# Altium project SNES TST Main.PrjPcb (part 2 of 2)

## Sheet Connectors.SchDoc: SNES TST Main
size A4; SheetNumber: 4; SheetTotal: 7
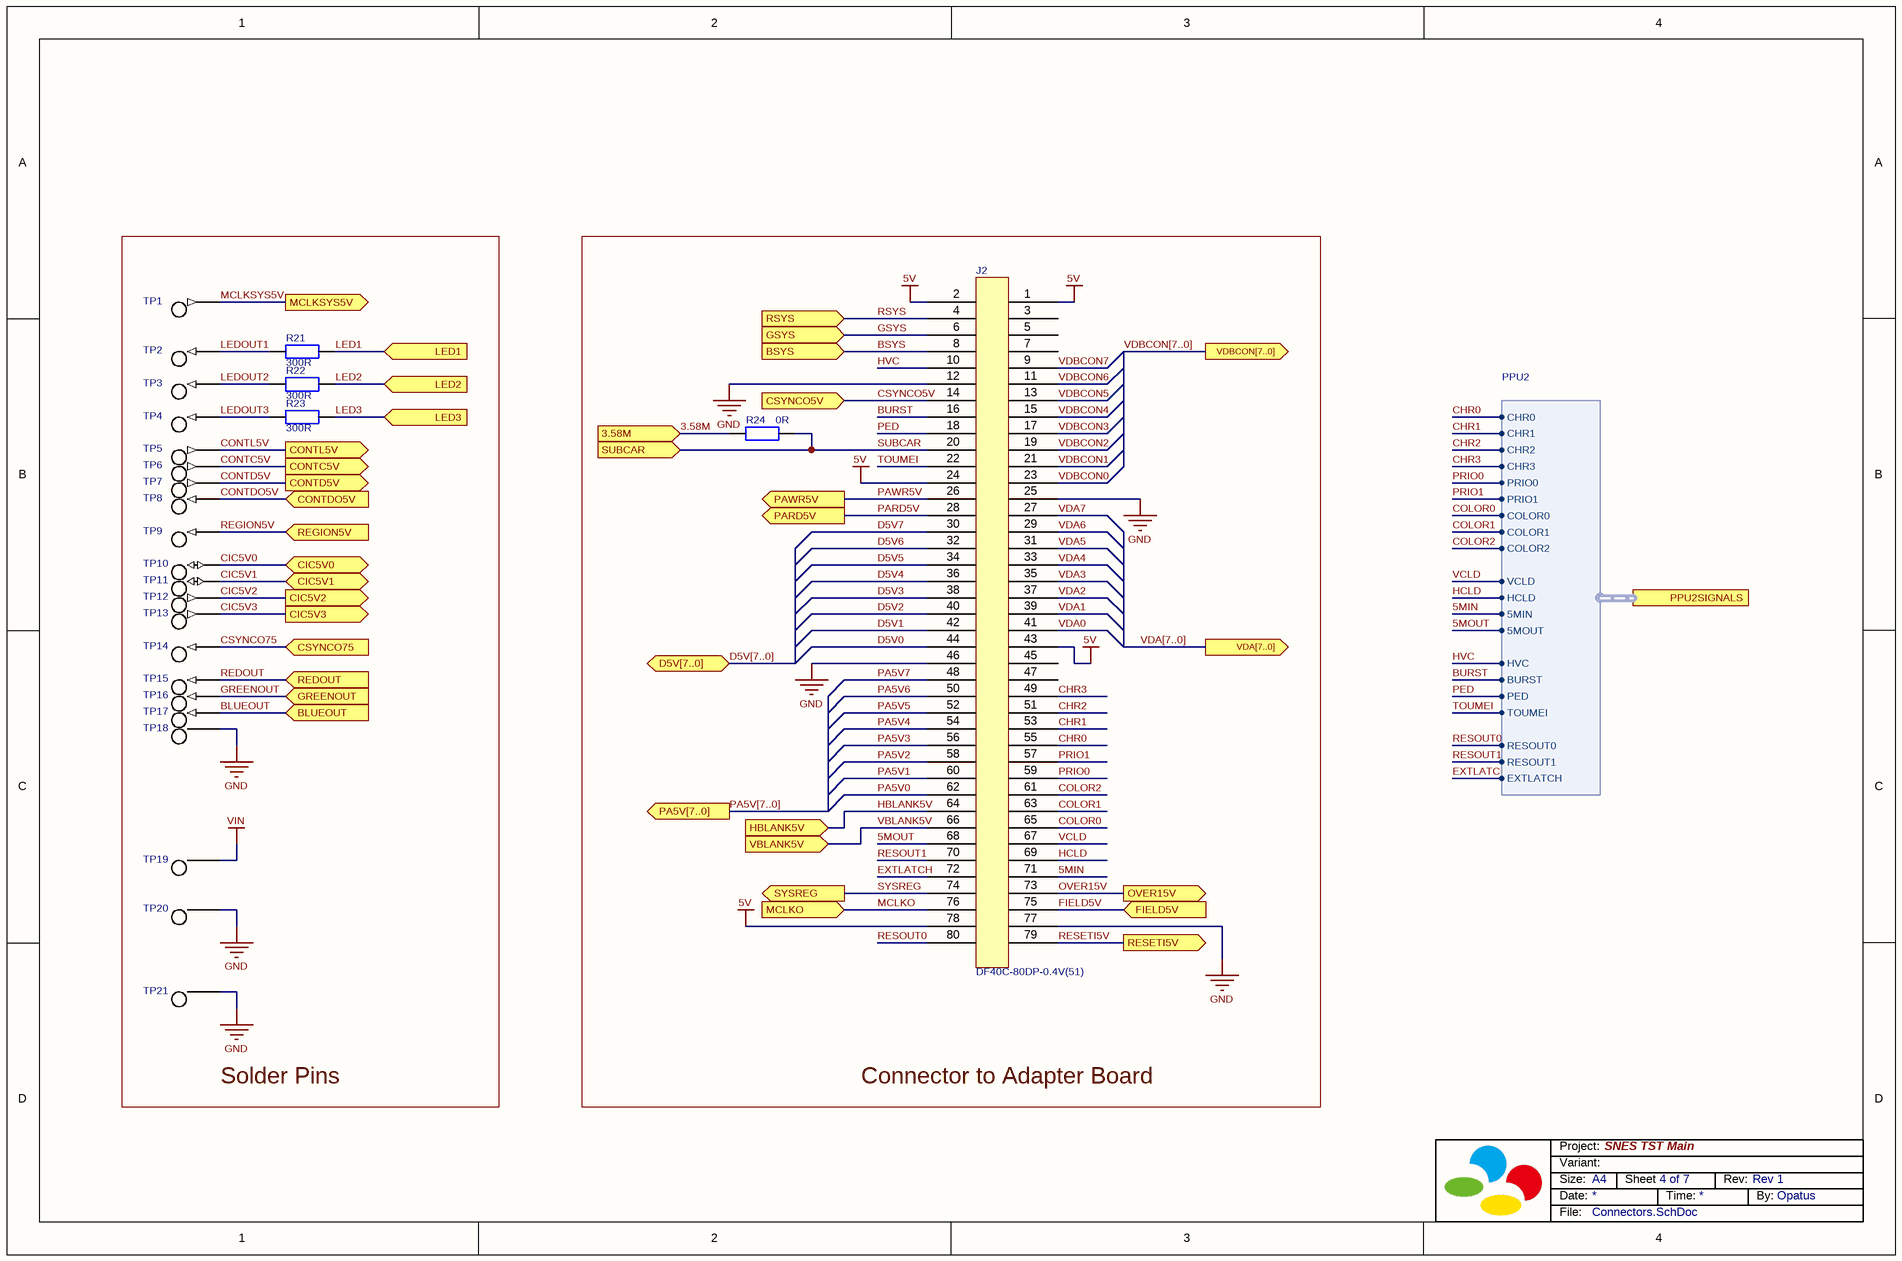
[diagram p6: Connectors.SchDoc]

### Parts
J2  Manufacturer_Part_Number: DF40C-80DP-0.4V(51)  [DF40C-80DP]  (hidden comment: DF40C-80DP)
R21  value 300R  [Res_0603_Chip]  (hidden comment: Resistor 300R 0603 ±1%)
R22  value 300R  [Res_0603_Chip]  (hidden comment: Resistor 300R 0603 ±1%)
R23  value 300R  [Res_0603_Chip]  (hidden comment: Resistor 300R 0603 ±1%)
R24  value 0R  [Res_0603_Chip]  (hidden comment: Resistor 0R 0603 ±1%)
TP1  Pin Connector  [Pin Connector Small]  (value not drawn)  (no BOM)
TP2  Pin Connector  [Pin Connector Small]  (value not drawn)  (no BOM)
TP3  Pin Connector  [Pin Connector Small]  (value not drawn)  (no BOM)
TP4  Pin Connector  [Pin Connector Small]  (value not drawn)  (no BOM)
TP5  Pin Connector  [Pin Connector Small]  (value not drawn)  (no BOM)
TP6  Pin Connector  [Pin Connector Small]  (value not drawn)  (no BOM)
TP7  Pin Connector  [Pin Connector Small]  (value not drawn)  (no BOM)
TP8  Pin Connector  [Pin Connector Small]  (value not drawn)  (no BOM)
TP9  Pin Connector  [Pin Connector Small]  (value not drawn)  (no BOM)
TP10  Pin Connector  [Pin Connector Small]  (value not drawn)  (no BOM)
TP11  Pin Connector  [Pin Connector Small]  (value not drawn)  (no BOM)
TP12  Pin Connector  [Pin Connector Small]  (value not drawn)  (no BOM)
TP13  Pin Connector  [Pin Connector Small]  (value not drawn)  (no BOM)
TP14  Pin Connector  [Pin Connector Small]  (value not drawn)  (no BOM)
TP15  Pin Connector  [Pin Connector Small]  (value not drawn)  (no BOM)
TP16  Pin Connector  [Pin Connector Small]  (value not drawn)  (no BOM)
TP17  Pin Connector  [Pin Connector Small]  (value not drawn)  (no BOM)
TP18  Pin Connector  [Pin Connector Small]  (value not drawn)  (no BOM)
TP19  Pin Connector  [Pin Connector Small]  (value not drawn)  (no BOM)
TP20  Pin Connector  [Pin Connector Small]  (value not drawn)  (no BOM)
TP21  Pin Connector  [Pin Connector Small]  (value not drawn)  (no BOM)

### Blocks framed on the sheet
Solder Pins: R21-R23 TP1-TP21
Connector to Adapter Board: J2 R24

### Ports
3.58M (in), BLUEOUT (in), BSYS (in), CIC5V0 (bidir), CIC5V1 (bidir), CIC5V2 (out), CIC5V3 (out), CONTC5V (out), CONTD5V (out), CONTDO5V (in), CONTL5V (out), CSYNCO5V (in), CSYNCO75 (in), D5V[7..0] (bidir), FIELD5V (in), GREENOUT (in), GSYS (in), HBLANK5V (in), LED1 (in), LED2 (in), LED3 (in), MCLKO (in), MCLKSYS5V (out), OVER15V (out), PA5V[7..0] (out), PARD5V (out), PAWR5V (out), PPU2SIGNALS (harness PPU2), REDOUT (in), REGION5V (in), RESETI5V (out), RSYS (in), SUBCAR (in), SYSREG (out), VBLANK5V (in), VDA[7..0] (out), VDBCON[7..0] (out)

### Harnesses
PPU2: CHR0, CHR1, CHR2, CHR3, PRIO0, PRIO1, COLOR0, COLOR1, COLOR2, VCLD, HCLD, 5MIN, 5MOUT, HVC, BURST, PED, TOUMEI, RESOUT0, RESOUT1, EXTLATCH

### Nets
5V: J2.1 J2.2 J2.24 J2.43 J2.78
GND: J2.12 J2.25 J2.46 J2.77 TP18.1 TP20.1 TP21.1
VIN: TP19.1
3.58M: R24.2 ; port 3.58M
5MIN: J2.71 ; port PPU2SIGNALS.5MIN
5MOUT: J2.68 ; port PPU2SIGNALS.5MOUT
BLUEOUT: TP17.1 ; port BLUEOUT
BSYS: J2.8 ; port BSYS
BURST: J2.16 ; port PPU2SIGNALS.BURST
CHR0: J2.55 ; port PPU2SIGNALS.CHR0
CHR1: J2.53 ; port PPU2SIGNALS.CHR1
CHR2: J2.51 ; port PPU2SIGNALS.CHR2
CHR3: J2.49 ; port PPU2SIGNALS.CHR3
CIC5V0: TP10.1 ; port CIC5V0
CIC5V1: TP11.1 ; port CIC5V1
CIC5V2: TP12.1 ; port CIC5V2
CIC5V3: TP13.1 ; port CIC5V3
COLOR0: J2.65 ; port PPU2SIGNALS.COLOR0
COLOR1: J2.63 ; port PPU2SIGNALS.COLOR1
COLOR2: J2.61 ; port PPU2SIGNALS.COLOR2
CONTC5V: TP6.1 ; port CONTC5V
CONTD5V: TP7.1 ; port CONTD5V
CONTDO5V: TP8.1 ; port CONTDO5V
CONTL5V: TP5.1 ; port CONTL5V
CSYNCO5V: J2.14 ; port CSYNCO5V
CSYNCO75: TP14.1 ; port CSYNCO75
D5V0: J2.44
D5V1: J2.42
D5V2: J2.40
D5V3: J2.38
D5V4: J2.36
D5V5: J2.34
D5V6: J2.32
D5V7: J2.30
EXTLATCH: J2.72 ; port PPU2SIGNALS.EXTLATCH
FIELD5V: J2.75 ; port FIELD5V
GREENOUT: TP16.1 ; port GREENOUT
GSYS: J2.6 ; port GSYS
HBLANK5V: J2.64 ; port HBLANK5V
HCLD: J2.69 ; port PPU2SIGNALS.HCLD
HVC: J2.10 ; port PPU2SIGNALS.HVC
LED1: R21.2 ; port LED1
LED2: R22.2 ; port LED2
LED3: R23.2 ; port LED3
LEDOUT1: R21.1 TP2.1
LEDOUT2: R22.1 TP3.1
LEDOUT3: R23.1 TP4.1
MCLKO: J2.76 ; port MCLKO
MCLKSYS5V: TP1.1 ; port MCLKSYS5V
OVER15V: J2.73 ; port OVER15V
PA5V0: J2.62
PA5V1: J2.60
PA5V2: J2.58
PA5V3: J2.56
PA5V4: J2.54
PA5V5: J2.52
PA5V6: J2.50
PA5V7: J2.48
PARD5V: J2.28 ; port PARD5V
PAWR5V: J2.26 ; port PAWR5V
PED: J2.18 ; port PPU2SIGNALS.PED
PRIO0: J2.59 ; port PPU2SIGNALS.PRIO0
PRIO1: J2.57 ; port PPU2SIGNALS.PRIO1
REDOUT: TP15.1 ; port REDOUT
REGION5V: TP9.1 ; port REGION5V
RESETI5V: J2.79 ; port RESETI5V
RESOUT0: J2.80 ; port PPU2SIGNALS.RESOUT0
RESOUT1: J2.70 ; port PPU2SIGNALS.RESOUT1
RSYS: J2.4 ; port RSYS
SUBCAR: J2.20 R24.1 ; port SUBCAR
SYSREG: J2.74 ; port SYSREG
TOUMEI: J2.22 ; port PPU2SIGNALS.TOUMEI
VBLANK5V: J2.66 ; port VBLANK5V
VCLD: J2.67 ; port PPU2SIGNALS.VCLD
VDA0: J2.41
VDA1: J2.39
VDA2: J2.37
VDA3: J2.35
VDA4: J2.33
VDA5: J2.31
VDA6: J2.29
VDA7: J2.27
VDBCON0: J2.23
VDBCON1: J2.21
VDBCON2: J2.19
VDBCON3: J2.17
VDBCON4: J2.15
VDBCON5: J2.13
VDBCON6: J2.11
VDBCON7: J2.9

Not connected (* = marked no-connect by the designer): J2 3 5 7 45 47

### Buses and harness runs
bus D5V[7..0] = port D5V[7..0]
bus PA5V[7..0] = port PA5V[7..0]
bus VDA[7..0] = port VDA[7..0]
bus VDBCON[7..0] = port VDBCON[7..0]

### Notes on the sheet
- Size:
- Date:
- Variant:
- Project:
- A4
- Sheet
- Time:
- Rev:
- By:
- File:

### Library data of the parts
J2 = Conn 80P: 80Pole Connector; Manufacturer: Hirose Connector
R21-R24 = R: ChipSize: 0603; Tolerance: ±1%; PartType: Resistor

## Nets that join several sheets
3.3V: CPLD (43 pins), Power (6 pins), RGB Video Output (R50.2 R68.1), Voltage Shifters (26 pins)
3.3V_A: Power (C47.1 FB1.2), RGB Video Output (13 pins)
5V: CPLD (R6.1), Power (FB3.1 JP5.1 Q1.S R77.1), PPU2 (C16.1 C17.1 IC4.2 IC5.20), Voltage Shifters (23 pins), Connectors (5 pins)
5V_A: Power (C53.1 FB3.2), RGB Video Output (9 pins)
5V_PPU: Power (FB4.1 Q1.D), PPU2 (IC3.5 IC3.32 IC3.59 IC3.83)
GND: CPLD (38 pins), Power (16 pins), PPU2 (21 pins), RGB Video Output (41 pins), Voltage Shifters (40 pins), Connectors (7 pins)
PPU_AVCC: Power (C54.1 FB4.2), PPU2 (IC3.94)
VCCA: CPLD (8 pins), Power (FB2.2)
VIN: Power (7 pins), Connectors (TP19.1)
3.58M: PPU2 (IC3.3), Connectors (R24.2)
5MIN: PPU2 (IC3.38), Connectors (J2.71)
5MOUT: PPU2 (IC3.27), Connectors (J2.68)
AMPFILT: CPLD (IC1.6), RGB Video Output (IC21.9 R68.2 R70.1)
BDIG1: CPLD (IC1.26), RGB Video Output (IC20.15)
BDIG2: CPLD (IC1.25), RGB Video Output (IC20.16)
BDIG3: CPLD (IC1.24), RGB Video Output (IC20.17)
BDIG4: CPLD (IC1.22), RGB Video Output (IC20.18)
BDIG5: CPLD (IC1.21), RGB Video Output (IC20.19)
BDIG6: CPLD (IC1.17), RGB Video Output (IC20.20)
BDIG7: CPLD (IC1.15), RGB Video Output (IC20.21)
BDIG8: CPLD (IC1.14), RGB Video Output (IC20.22)
BDIG9: CPLD (IC1.13), RGB Video Output (IC20.23)
BLANKDAC: CPLD (IC1.30), RGB Video Output (IC20.11 R50.1)
BLUEOUT: RGB Video Output (JP4.1 R69.2), Connectors (TP17.1)
BPPU: PPU2 (IC3.97), RGB Video Output (IC18.2)
BSYS: RGB Video Output (IC18.4), Connectors (J2.8)
BURST: PPU2 (IC3.1), Connectors (J2.16)
CHR0: PPU2 (IC3.46), Connectors (J2.55)
CHR1: PPU2 (IC3.47), Connectors (J2.53)
CHR2: PPU2 (IC3.48), Connectors (J2.51)
CHR3: PPU2 (IC3.49), Connectors (J2.49)
CIC3V0: CPLD (IC1.52), Voltage Shifters (IC16.4)
CIC3V1: CPLD (IC1.54), Voltage Shifters (IC14.4)
CIC3V2: CPLD (IC1.55), Voltage Shifters (IC15.9)
CIC3V3: CPLD (IC1.56), Voltage Shifters (IC15.10)
CIC5V0: Voltage Shifters (IC16.3 R28.2), Connectors (TP10.1)
CIC5V1: Voltage Shifters (IC14.3 R27.2), Connectors (TP11.1)
CIC5V2: Voltage Shifters (IC15.3), Connectors (TP12.1)
CIC5V3: Voltage Shifters (IC15.2), Connectors (TP13.1)
CICDIR0: CPLD (IC1.62), Voltage Shifters (IC16.5)
CICDIR1: CPLD (IC1.97), Voltage Shifters (IC14.5)
COLOR0: PPU2 (IC3.41), Connectors (J2.65)
COLOR1: PPU2 (IC3.42), Connectors (J2.63)
COLOR2: PPU2 (IC3.43), Connectors (J2.61)
CONTC3V: CPLD (IC1.50), Voltage Shifters (IC12.9)
CONTC5V: Voltage Shifters (IC12.3), Connectors (TP6.1)
CONTD3V: CPLD (IC1.129 R19.2), Voltage Shifters (IC12.8)
CONTD5V: Voltage Shifters (IC12.4), Connectors (TP7.1)
CONTDO3V: CPLD (IC1.48), Voltage Shifters (IC12.7)
CONTDO5V: Voltage Shifters (IC12.5), Connectors (TP8.1)
CONTL3V: CPLD (IC1.47), Voltage Shifters (IC12.10)
CONTL5V: Voltage Shifters (IC12.2), Connectors (TP5.1)
CSYNCDAC: CPLD (IC1.27), RGB Video Output (IC20.12 R54.2)
CSYNCI3V: CPLD (IC1.100), Voltage Shifters (IC8.8)
CSYNCI5V: PPU2 (IC3.100), Voltage Shifters (IC8.13)
CSYNCO3V: CPLD (IC1.106 R13.2 R17.1), RGB Video Output (IC17.5)
CSYNCO5V: RGB Video Output (IC17.7 R34.1 R39.1), Connectors (J2.14)
CSYNCO75: RGB Video Output (JP1.1 R34.2), Connectors (TP14.1)
D3V0: CPLD (IC1.84), Voltage Shifters (IC9.1)
D3V1: CPLD (IC1.85), Voltage Shifters (IC9.2)
D3V2: CPLD (IC1.86), Voltage Shifters (IC9.3)
D3V3: CPLD (IC1.87), Voltage Shifters (IC9.4)
D3V4: CPLD (IC1.89), Voltage Shifters (IC9.7)
D3V5: CPLD (IC1.90), Voltage Shifters (IC9.8)
D3V6: CPLD (IC1.91), Voltage Shifters (IC9.9)
D3V7: CPLD (IC1.92), Voltage Shifters (IC9.10)
D5V0: PPU2 (IC3.15), Voltage Shifters (IC9.20), Connectors (J2.44)
D5V1: PPU2 (IC3.14), Voltage Shifters (IC9.19), Connectors (J2.42)
D5V2: PPU2 (IC3.13), Voltage Shifters (IC9.18), Connectors (J2.40)
D5V3: PPU2 (IC3.12), Voltage Shifters (IC9.17), Connectors (J2.38)
D5V4: PPU2 (IC4.5), Voltage Shifters (IC9.14), Connectors (J2.36)
D5V5: PPU2 (IC3.10), Voltage Shifters (IC9.13), Connectors (J2.34)
D5V6: PPU2 (IC3.9), Voltage Shifters (IC9.12), Connectors (J2.32)
D5V7: PPU2 (IC3.8), Voltage Shifters (IC9.11), Connectors (J2.30)
DACCLK: CPLD (R5.2), RGB Video Output (IC20.24)
EXTLATCH: PPU2 (IC3.29), Connectors (J2.72)
FIELD3V: CPLD (IC1.98), Voltage Shifters (IC8.4)
FIELD5V: PPU2 (IC3.36), Voltage Shifters (IC8.17), Connectors (J2.75)
GDIG1: CPLD (IC1.46), RGB Video Output (IC20.2)
GDIG2: CPLD (IC1.45), RGB Video Output (IC20.3)
GDIG3: CPLD (IC1.44), RGB Video Output (IC20.4)
GDIG4: CPLD (IC1.43), RGB Video Output (IC20.5)
GDIG5: CPLD (IC1.41), RGB Video Output (IC20.6)
GDIG6: CPLD (IC1.39), RGB Video Output (IC20.7)
GDIG7: CPLD (IC1.38), RGB Video Output (IC20.8)
GDIG8: CPLD (IC1.33), RGB Video Output (IC20.9)
GDIG9: CPLD (IC1.32), RGB Video Output (IC20.10)
GPPU: PPU2 (IC3.96), RGB Video Output (IC18.5)
GREENOUT: RGB Video Output (JP3.1 R60.2), Connectors (TP16.1)
GSYS: RGB Video Output (IC18.7), Connectors (J2.6)
HBLANK3V: CPLD (IC1.60), Voltage Shifters (IC11.3)
HBLANK5V: PPU2 (IC3.25), Voltage Shifters (IC11.18), Connectors (J2.64)
HCLD: PPU2 (IC3.39), Connectors (J2.69)
HVC: PPU2 (IC3.98), Connectors (J2.10)
LED1: CPLD (IC1.69), Connectors (R21.2)
LED2: CPLD (IC1.70), Connectors (R22.2)
LED3: CPLD (IC1.126 R14.2), Connectors (R23.2)
MCLKO: CPLD (R16.1), PPU2 (IC3.31), Connectors (J2.76)
MCLKSYS5V: CPLD (R10.2), Connectors (TP1.1)
MD7PAT3V: CPLD (IC1.58), Voltage Shifters (IC11.1)
MD7PAT5V: PPU2 (IC5.1), Voltage Shifters (IC11.20)
OVER13V: CPLD (IC1.57), Voltage Shifters (IC11.2)
OVER15V: Voltage Shifters (IC11.19), Connectors (J2.73)
OVERPAT3V: CPLD (IC1.61), Voltage Shifters (IC11.8)
OVERPAT5V: PPU2 (IC3.37 IC3.50), Voltage Shifters (IC11.13)
PA3V0: CPLD (IC1.74), Voltage Shifters (IC6.1)
PA3V1: CPLD (IC1.75), Voltage Shifters (IC6.2)
PA3V2: CPLD (IC1.76), Voltage Shifters (IC6.3)
PA3V3: CPLD (IC1.77), Voltage Shifters (IC6.4)
PA3V4: CPLD (IC1.78), Voltage Shifters (IC6.7)
PA3V5: CPLD (IC1.79), Voltage Shifters (IC6.8)
PA3V6: CPLD (IC1.80), Voltage Shifters (IC6.9)
PA3V7: CPLD (IC1.81), Voltage Shifters (IC6.10)
PA5V0: PPU2 (IC3.24), Voltage Shifters (IC6.20), Connectors (J2.62)
PA5V1: PPU2 (IC3.23), Voltage Shifters (IC6.19), Connectors (J2.60)
PA5V2: PPU2 (IC3.22), Voltage Shifters (IC6.18), Connectors (J2.58)
PA5V3: PPU2 (IC3.21), Voltage Shifters (IC6.17), Connectors (J2.56)
PA5V4: PPU2 (IC3.20), Voltage Shifters (IC6.14), Connectors (J2.54)
PA5V5: PPU2 (IC3.19), Voltage Shifters (IC6.13), Connectors (J2.52)
PA5V6: PPU2 (IC3.18), Voltage Shifters (IC6.12), Connectors (J2.50)
PA5V7: PPU2 (IC3.17), Voltage Shifters (IC6.11), Connectors (J2.48)
PARD3V: CPLD (IC1.93), Voltage Shifters (IC8.2)
PARD5V: PPU2 (IC3.7), Voltage Shifters (IC8.19), Connectors (J2.28)
PAWR3V: CPLD (IC1.96), Voltage Shifters (IC8.3)
PAWR5V: PPU2 (IC3.6), Voltage Shifters (IC8.18), Connectors (J2.26)
PED: PPU2 (IC3.2), Connectors (J2.18)
PPURST: CPLD (IC1.136 R12.2), Power (R78.1)
PRIO0: PPU2 (IC3.44), Connectors (J2.59)
PRIO1: PPU2 (IC3.45), Connectors (J2.57)
RDIG1: CPLD (IC1.121), RGB Video Output (IC20.40)
RDIG2: CPLD (IC1.120), RGB Video Output (IC20.41)
RDIG3: CPLD (IC1.119), RGB Video Output (IC20.42)
RDIG4: CPLD (IC1.118), RGB Video Output (IC20.43)
RDIG5: CPLD (IC1.114), RGB Video Output (IC20.44)
RDIG6: CPLD (IC1.113), RGB Video Output (IC20.45)
RDIG7: CPLD (IC1.112), RGB Video Output (IC20.46)
RDIG8: CPLD (IC1.111), RGB Video Output (IC20.47)
RDIG9: CPLD (IC1.110), RGB Video Output (IC20.48)
REDOUT: RGB Video Output (JP2.1 R58.2), Connectors (TP15.1)
REGION3V: CPLD (IC1.66), Voltage Shifters (IC11.7)
REGION5V: PPU2 (IC3.30 R20.1), Voltage Shifters (IC11.14), Connectors (TP9.1)
REGPAT3V: CPLD (IC1.99), Voltage Shifters (IC8.7)
REGPAT5V: PPU2 (IC4.6), Voltage Shifters (IC8.14)
REGPSEL3V: CPLD (IC1.102), Voltage Shifters (IC8.10)
REGPSEL5V: PPU2 (IC4.1), Voltage Shifters (IC8.11)
RESETI3V: CPLD (IC1.59), Voltage Shifters (IC15.8)
RESETI5V: Voltage Shifters (IC15.4 R29.1), Connectors (J2.79)
RESETO3V: CPLD (IC1.65), Voltage Shifters (IC15.7)
RESETO5V: PPU2 (IC3.34), Voltage Shifters (IC15.5 R30.2)
RESOUT0: PPU2 (IC3.33), Connectors (J2.80)
RESOUT1: PPU2 (IC3.28), Connectors (J2.70)
RGBSEL3V: CPLD (IC1.101), Voltage Shifters (IC8.9)
RGBSEL5V: RGB Video Output (IC18.1), Voltage Shifters (IC8.12)
RPPU: PPU2 (IC3.95), RGB Video Output (IC18.11)
RSYS: RGB Video Output (IC18.9), Connectors (J2.4)
SUBCAR: Voltage Shifters (R25.1 R26.1), Connectors (J2.20 R24.1)
SUBCAR3V: CPLD (IC1.105), Voltage Shifters (IC13.3)
SYSREG: PPU2 (R20.2), Connectors (J2.74)
TOUMEI: PPU2 (IC3.4), Connectors (J2.22)
TST3V0: CPLD (IC1.11), Voltage Shifters (IC7.1)
TST3V1: CPLD (IC1.10), Voltage Shifters (IC7.2)
TST3V2: CPLD (IC1.8), Voltage Shifters (IC7.3)
TST3V3: CPLD (IC1.7), Voltage Shifters (IC7.4)
TST3V4: CPLD (IC1.141), Voltage Shifters (IC7.7)
TST3V5: CPLD (IC1.140), Voltage Shifters (IC7.8)
TST3V6: CPLD (IC1.135), Voltage Shifters (IC7.9)
TST3V7: CPLD (IC1.134), Voltage Shifters (IC7.10)
TST3V8: CPLD (IC1.132), Voltage Shifters (IC10.1)
TST3V9: CPLD (IC1.131), Voltage Shifters (IC10.2)
TST3V10: CPLD (IC1.130), Voltage Shifters (IC10.3)
TST3V11: CPLD (IC1.127), Voltage Shifters (IC10.4)
TST3V12: CPLD (IC1.122), Voltage Shifters (IC10.7)
TST3V13: CPLD (IC1.123), Voltage Shifters (IC10.8)
TST3V14: CPLD (IC1.124), Voltage Shifters (IC10.9)
TST3V15: CPLD (IC1.12), Voltage Shifters (IC10.10)
TST5V0: PPU2 (IC3.77), Voltage Shifters (IC7.20)
TST5V1: PPU2 (IC3.78), Voltage Shifters (IC7.19)
TST5V2: PPU2 (IC3.79), Voltage Shifters (IC7.18)
TST5V3: PPU2 (IC3.80), Voltage Shifters (IC7.17)
TST5V4: PPU2 (IC3.81), Voltage Shifters (IC7.14)
TST5V5: PPU2 (IC3.82), Voltage Shifters (IC7.13)
TST5V6: PPU2 (IC3.84), Voltage Shifters (IC7.12)
TST5V7: PPU2 (IC3.85), Voltage Shifters (IC7.11)
TST5V8: PPU2 (IC3.86), Voltage Shifters (IC10.20)
TST5V9: PPU2 (IC3.87), Voltage Shifters (IC10.19)
TST5V10: PPU2 (IC3.88), Voltage Shifters (IC10.18)
TST5V11: PPU2 (IC3.89), Voltage Shifters (IC10.17)
TST5V12: PPU2 (IC3.90 RN1.5), Voltage Shifters (IC10.14)
TST5V13: PPU2 (IC3.91 RN1.6), Voltage Shifters (IC10.13)
TST5V14: PPU2 (IC3.92 RN1.7), Voltage Shifters (IC10.12)
TST5V15: PPU2 (IC3.93 RN1.8), Voltage Shifters (IC10.11)
VBLANK3V: CPLD (IC1.64), Voltage Shifters (IC11.4)
VBLANK5V: PPU2 (IC3.26), Voltage Shifters (IC11.17), Connectors (J2.66)
VCLD: PPU2 (IC3.40), Connectors (J2.67)
VDA0: PPU2 (IC3.60), Connectors (J2.41)
VDA1: PPU2 (IC3.61), Connectors (J2.39)
VDA2: PPU2 (IC3.62), Connectors (J2.37)
VDA3: PPU2 (IC3.63), Connectors (J2.35)
VDA4: PPU2 (IC3.64), Connectors (J2.33)
VDA5: PPU2 (IC3.65), Connectors (J2.31)
VDA6: PPU2 (IC3.66), Connectors (J2.29)
VDA7: PPU2 (IC3.67), Connectors (J2.27)
VDBCON0: PPU2 (IC5.2), Connectors (J2.23)
VDBCON1: PPU2 (IC5.3), Connectors (J2.21)
VDBCON2: PPU2 (IC5.4), Connectors (J2.19)
VDBCON3: PPU2 (IC5.5), Connectors (J2.17)
VDBCON4: PPU2 (IC5.6), Connectors (J2.15)
VDBCON5: PPU2 (IC5.7), Connectors (J2.13)
VDBCON6: PPU2 (IC5.8), Connectors (J2.11)
VDBCON7: PPU2 (IC5.9), Connectors (J2.9)

## Assembly variants
NTSC System: not fitted C46 C47 IC21 R6 R13 R24 R57 R59 R61 R65 R66 R67 R68
PAL System: not fitted IC16 R5 R13 R24 R28 R30 R53 R54 R56 R70